# Altium schematic sheet POWER.SchDoc
size A4; SheetNumber: 3; SheetTotal: 4
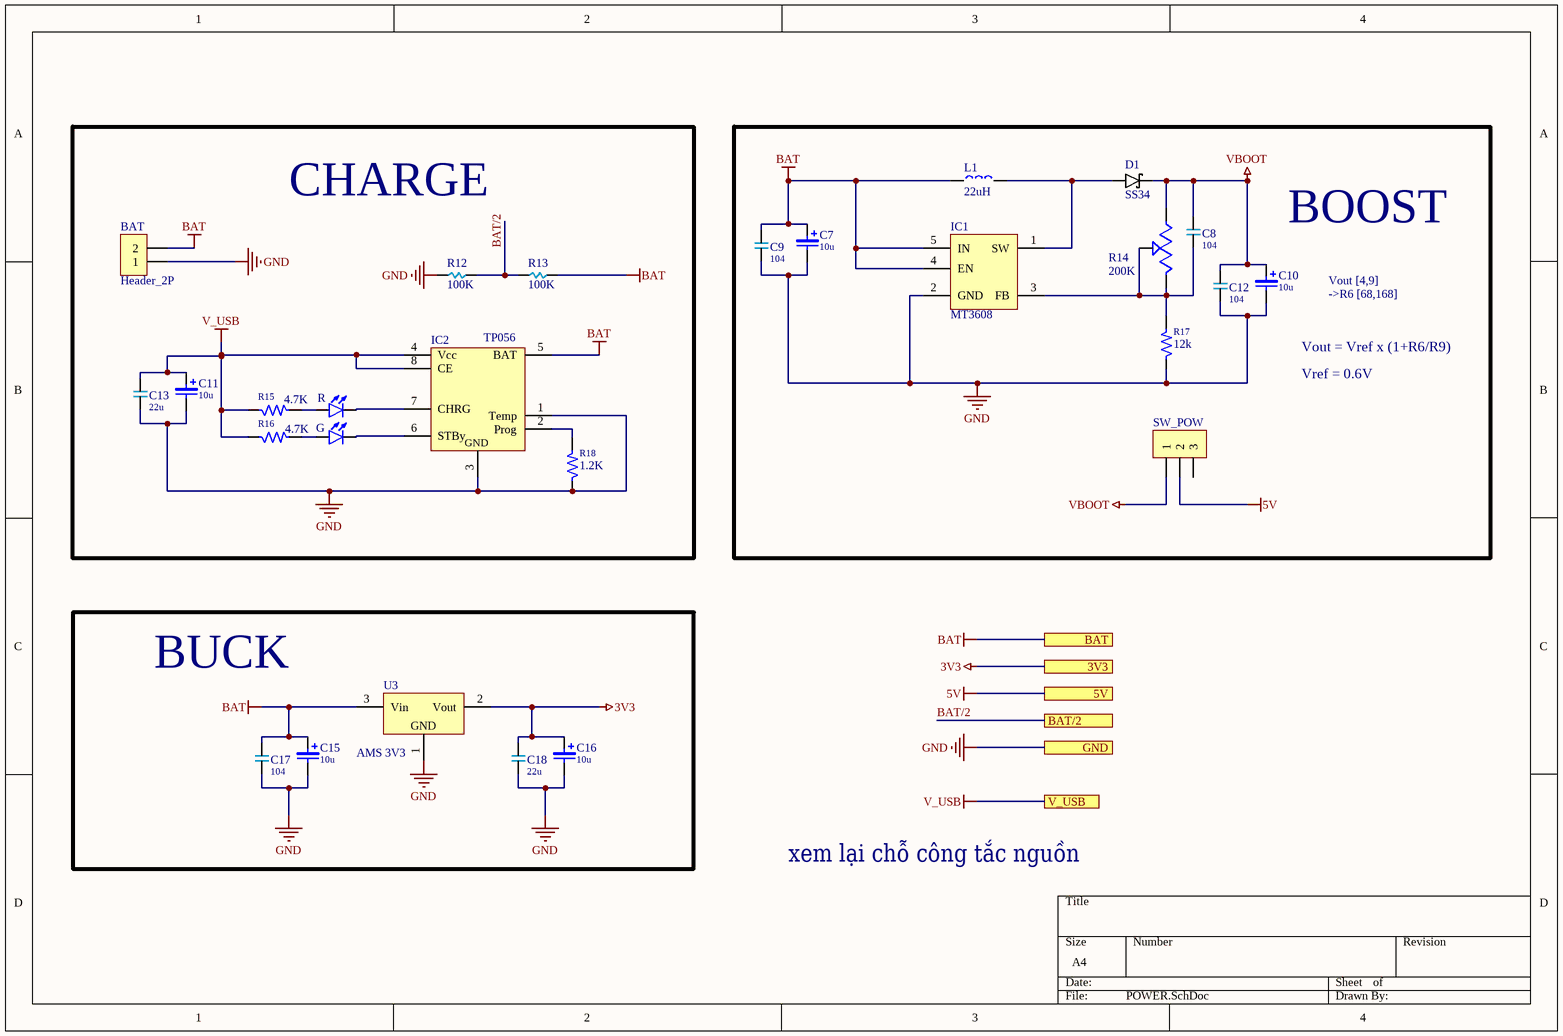
[diagram p0: POWER.SchDoc]

## Parts
BAT  Header_2P  [2P_1.5_V]
C7  10u  [CAP_T 3216 (1208)]
C8  104  [CAP 0603]
C9  104  [CAP 0603]
C10  10u  [CAP_T 3216 (1208)]
C11  10u  [CAP_T 3216 (1208)]
C12  104  [CAP 0603]
C13  22u  [CAP 0603]
C15  10u  [CAP_T 3216 (1208)]
C16  10u  [CAP_T 3216 (1208)]
C17  104  [CAP 0603]
C18  22u  [CAP 0603]
D1  SS34  [DO214AC-SMA]
G  Green  [LED 0603]  (value not drawn)
IC1  MT3608  [SOT23-6]
IC2  TP056  [SOIC 8]
L1  22uH  [INDUCTOR 0630]
R  Green  [LED 0603]  (value not drawn)
R12  100K  [RES 0603]
R13  100K  [RES 0603]
R14  200K  [RES VARIABLE]
R15  4.7K  [RES 0603]
R16  4.7K  [RES 0603]
R17  12k  [RES 0603]
R18  1.2K  [RES 0603]
SW_POW  SWITCH  [Switch SK12D07]  (value not drawn)
U3  AMS 3V3  [SOT223]

## Blocks framed on the sheet
CHARGE: BAT C11 C13 G IC2 R R12 R13 R15 R16 R18
BOOST: C7-C10 C12 D1 IC1 L1 R14 R17 SW_POW
BUCK: C15-C18 U3

## Ports
3V3, 5V, BAT, BAT/2, GND, V_USB

## Nets
3V3: C16.1 C18.2 U3.2(Vout) ; port 3V3
5V: SW_POW.2 ; port 5V
BAT: BAT.2 C7.1 C9.2 C15.1 C17.2 IC1.4(EN) IC1.5(IN) IC2.5(BAT) L1.1 R13.1 U3.3(Vin) ; port BAT
GND: BAT.1 C7.2 C9.1 C10.2 C11.2 C12.1 C13.1 C15.2 C16.2 C17.1 C18.1 IC1.2(GND) IC2.1(Temp) IC2.3(Gnd) R12.2 R17.1 R18.1 U3.1(gnd) ; port GND
V_USB: C11.1 C13.2 IC2.4(Vcc) IC2.8(CE) R15.1 R16.1 ; port V_USB
VBOOT: C8.2 C10.1 C12.2 D1.K R14.1 SW_POW.1
BAT/2: R12.1 R13.2 ; port BAT/2
NetC8_1: C8.1 IC1.3(FB) R14.2 R14.3 R17.2
NetD1_A: D1.A IC1.1(SW) L1.2
NetG_A: G.A R16.2
NetG_K: G.K IC2.6(STBy)
NetIC2_2: IC2.2(Prog) R18.2
NetIC2_7: IC2.7(CHRG) R.K
NetR_A: R.A R15.2

Not connected (* = marked no-connect by the designer): SW_POW 3

## Notes on the sheet
- Vout [4,9]
- ->R6 [68,168]
- Vout = Vref x (1+R6/R9)
- Vref = 0.6V
- xem lại chỗ công tắc nguồn
- (in symbol AMS1117) GND
- (in symbol TP4056) GND

## Library data of the parts
C7 C10 C11 C15 C16 = CAP_T: Value: 10u
C8 C9 C12 C13 C17 C18 = CAP
  C8 C9 C12 C17: Value: 104
  C13 C18: Value: 22u
D1 = DIODE S
G R = LED SM: Value: Green
IC2 = TP4056
L1 = IDT: Value: 22uH
R12 R13 = RES: Value: 100K
R14 = Res_variable: SMD
R15-R18 = Res SMD: Res 0805
U3 = AMS1117